# Altium project PCB_Project1.PrjPCB
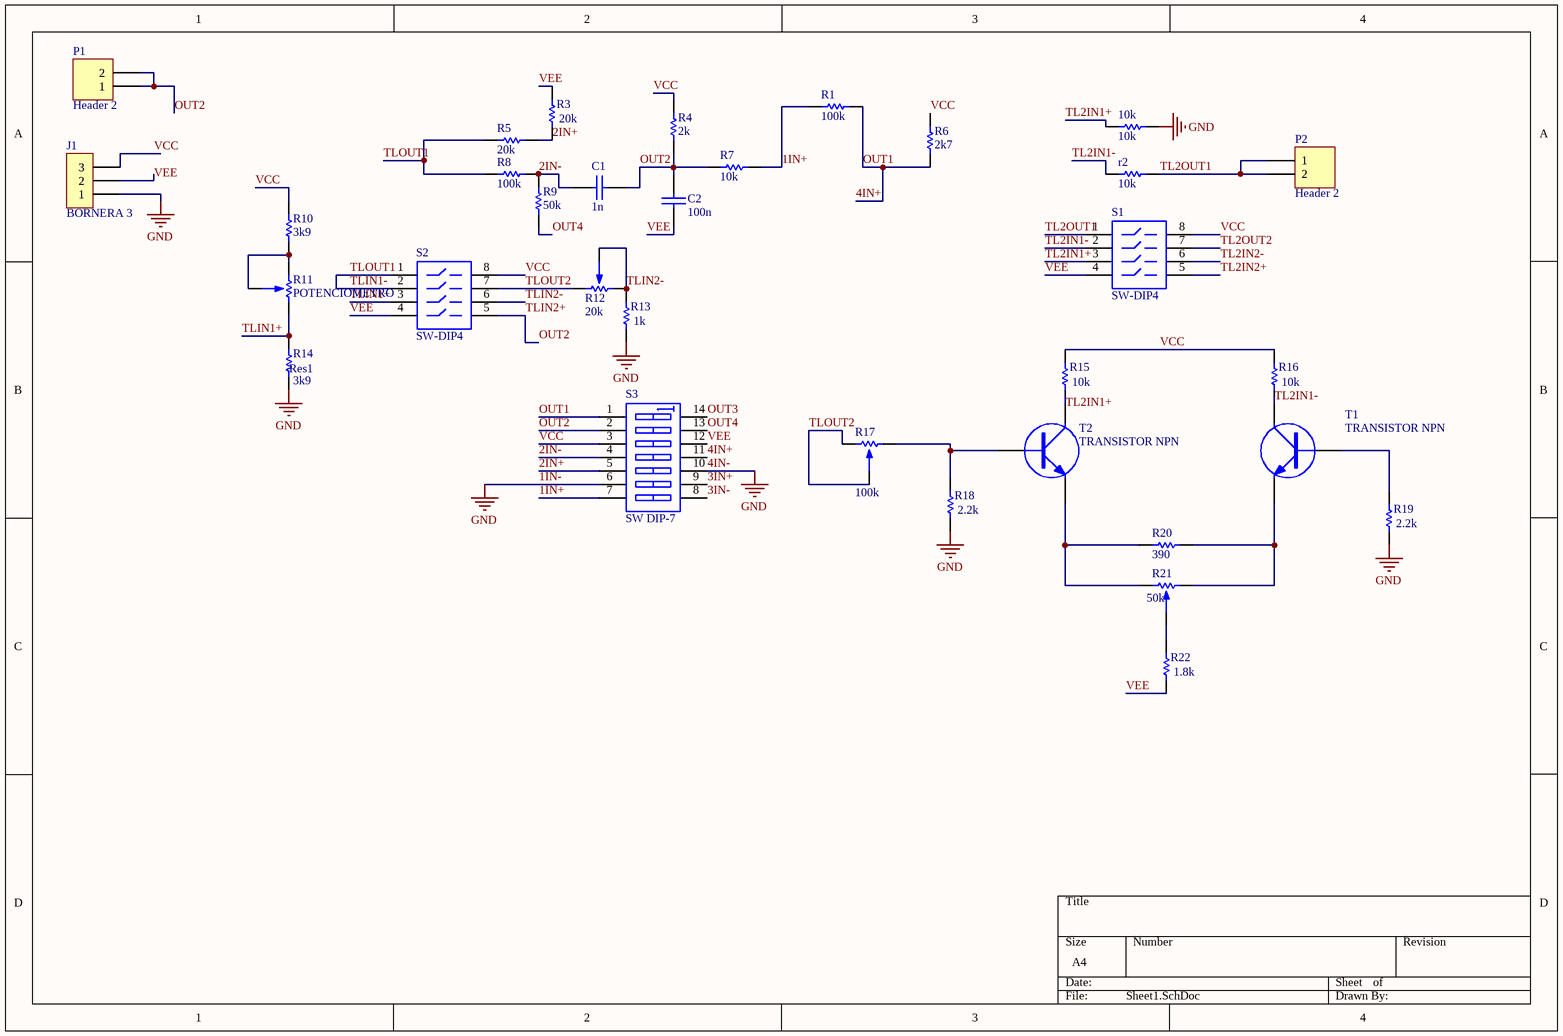
[diagram p0: Sheet1.SchDoc]
1 sheet, 33 parts. Net scope: global (net labels, ports and power ports of the same name join across sheets).
Board file: PCB1.PcbDoc

## Sheet Sheet1.SchDoc
size A4

### Parts
10k  10k  [RES600]
C1  1n  [CAP200]
C2  100n  [CAP200]
J1  BORNERA 3  [BORNERA3]
P1  Header 2  [HDR1X2]
P2  Header 2  [HDR1X2]
R1  100k  [RES600]
r2  10k  [RES600]
R3  20k  [RES600]
R4  2k  [RES600]
R5  20k  [RES600]
R6  2k7  [RES600]
R7  10k  [RES600]
R8  100k  [RES600]
R9  50k  [RES600]
R10  3k9  [RES600]
R11  POTENCIOMETRO  [POTENCIOMETRO]
R12  20k  [PRESET V]
R13  1k  [RES600]
R14  Res1  value 3k9  [AXIAL-0.3]
R15  10k  [RES600]
R16  10k  [RES600]
R17  100k  [PRESET V]
R18  2.2k  [RES600]
R19  2.2k  [RES600]
R20  390  [RES600]
R21  50k  [PRESET V]
R22  1.8k  [RES600]
S1  SW-DIP4  [DIP-8]
S2  SW-DIP4  [DIP-8]
S3  SW DIP-7  [DIP-14]
T1  TRANSISTOR NPN  [TO92]
T2  TRANSISTOR NPN  [TO92]

### Nets
1IN-: 10k.2 J1.1 R13.2 R14.1 R18.2 R19.2 S3.6(A6) S3.10(B5)  [also labelled 4IN-, GND]
1IN+: R1.2 R7.1 S3.7(A7)
2IN+: R3.1 R5.2 S3.5(A5)
2IN-: C1.1 R8.2 R9.2 S3.4(A4)
3IN+: S3.9(B6)
3IN-: S3.8(B7)
4IN+: R1.1 R6.2 S3.1(A1) S3.11(B4)  [also labelled OUT1]
OUT2: C1.2 C2.2 P1.1 P1.2 R4.1 R7.2 S2.5 S3.2(A2)  [also labelled TLIN2+]
OUT3: S3.14(B1)
OUT4: R9.1 S3.13(B2)
TL2IN1+: 10k.1 S1.3
TL2IN1-: r2.1 R16.2 S1.2 T1.2(C)
TL2IN2+: S1.5
TL2IN2-: S1.6
TL2OUT1: P2.1 P2.2 r2.2 S1.1
TL2OUT2: S1.7
TLIN1+: R11.1 R14.2 S2.3
TLIN1-: R5.1 R8.1 S2.1 S2.2  [also labelled TLOUT1]
TLIN2-: R12.2 R12.3 R13.1 S2.6
TLOUT2: R12.1 R17.2 R17.3 S2.7
VCC: J1.3 R4.2 R6.1 R10.2 R15.1 R16.1 S1.8 S2.8 S3.3(A3)
VEE: C2.1 J1.2 R3.2 R22.2 S1.4 S2.4 S3.12(B3)
NetR10_1: R10.1 R11.2 R11.3
NetR15_2: R15.2 T2.2(C)
NetR17_1: R17.1 R18.1 T2.1(B)
NetR19_1: R19.1 T1.1(B)
NetR20_1: R20.1 R21.1 T1.3(E)
NetR20_2: R20.2 R21.3 T2.3(E)
NetR21_2: R21.2 R22.1

### Notes on the sheet
- Labels drawn without touching a wire or pin: TL2IN1+

### Library data of the parts
10k R1 r2 R3-R10 R13 R15 R16 R18-R20 R22 = RES
C1 C2 = CAP
P1 P2 = Header 2: Header, 2-Pin; LatestRevisionDate: 17-Jul-2002; LatestRevisionNote: Re-released for DXP Platform.; Publisher: Altium Limited
R12 R17 R21 = PRESET
R14 = Res1: Resistor; Published: 8-Jun-2000; LatestRevisionDate: 17-Jul-2002; LatestRevisionNote: Re-released for DXP Platform.; PackageReference: AXIAL-0.3; Publisher: Altium Limited; PackageDescription: Axial Device, Thru-Hole; 2 Leads; 0.3 in Pin Spacing
S1 S2 = SW-DIP4: DIP Switch; Published: 24-Mar-1999; LatestRevisionDate: 17-Jul-2002; LatestRevisionNote: Re-released for DXP Platform.; PackageReference: DIP-8; Publisher: Altium Limited
S3 = SW DIP-7: DIP Switch, 7 Position, SPST; Published: 24-Mar-1999; LatestRevisionDate: 17-Jul-2002; LatestRevisionNote: Re-released for DXP Platform.; PackageReference: DIP-14; Publisher: Altium Limited; Code_JEDEC: MO-001-AF